# EAGLE design RTC_V2_pb (EAGLE 6.1)
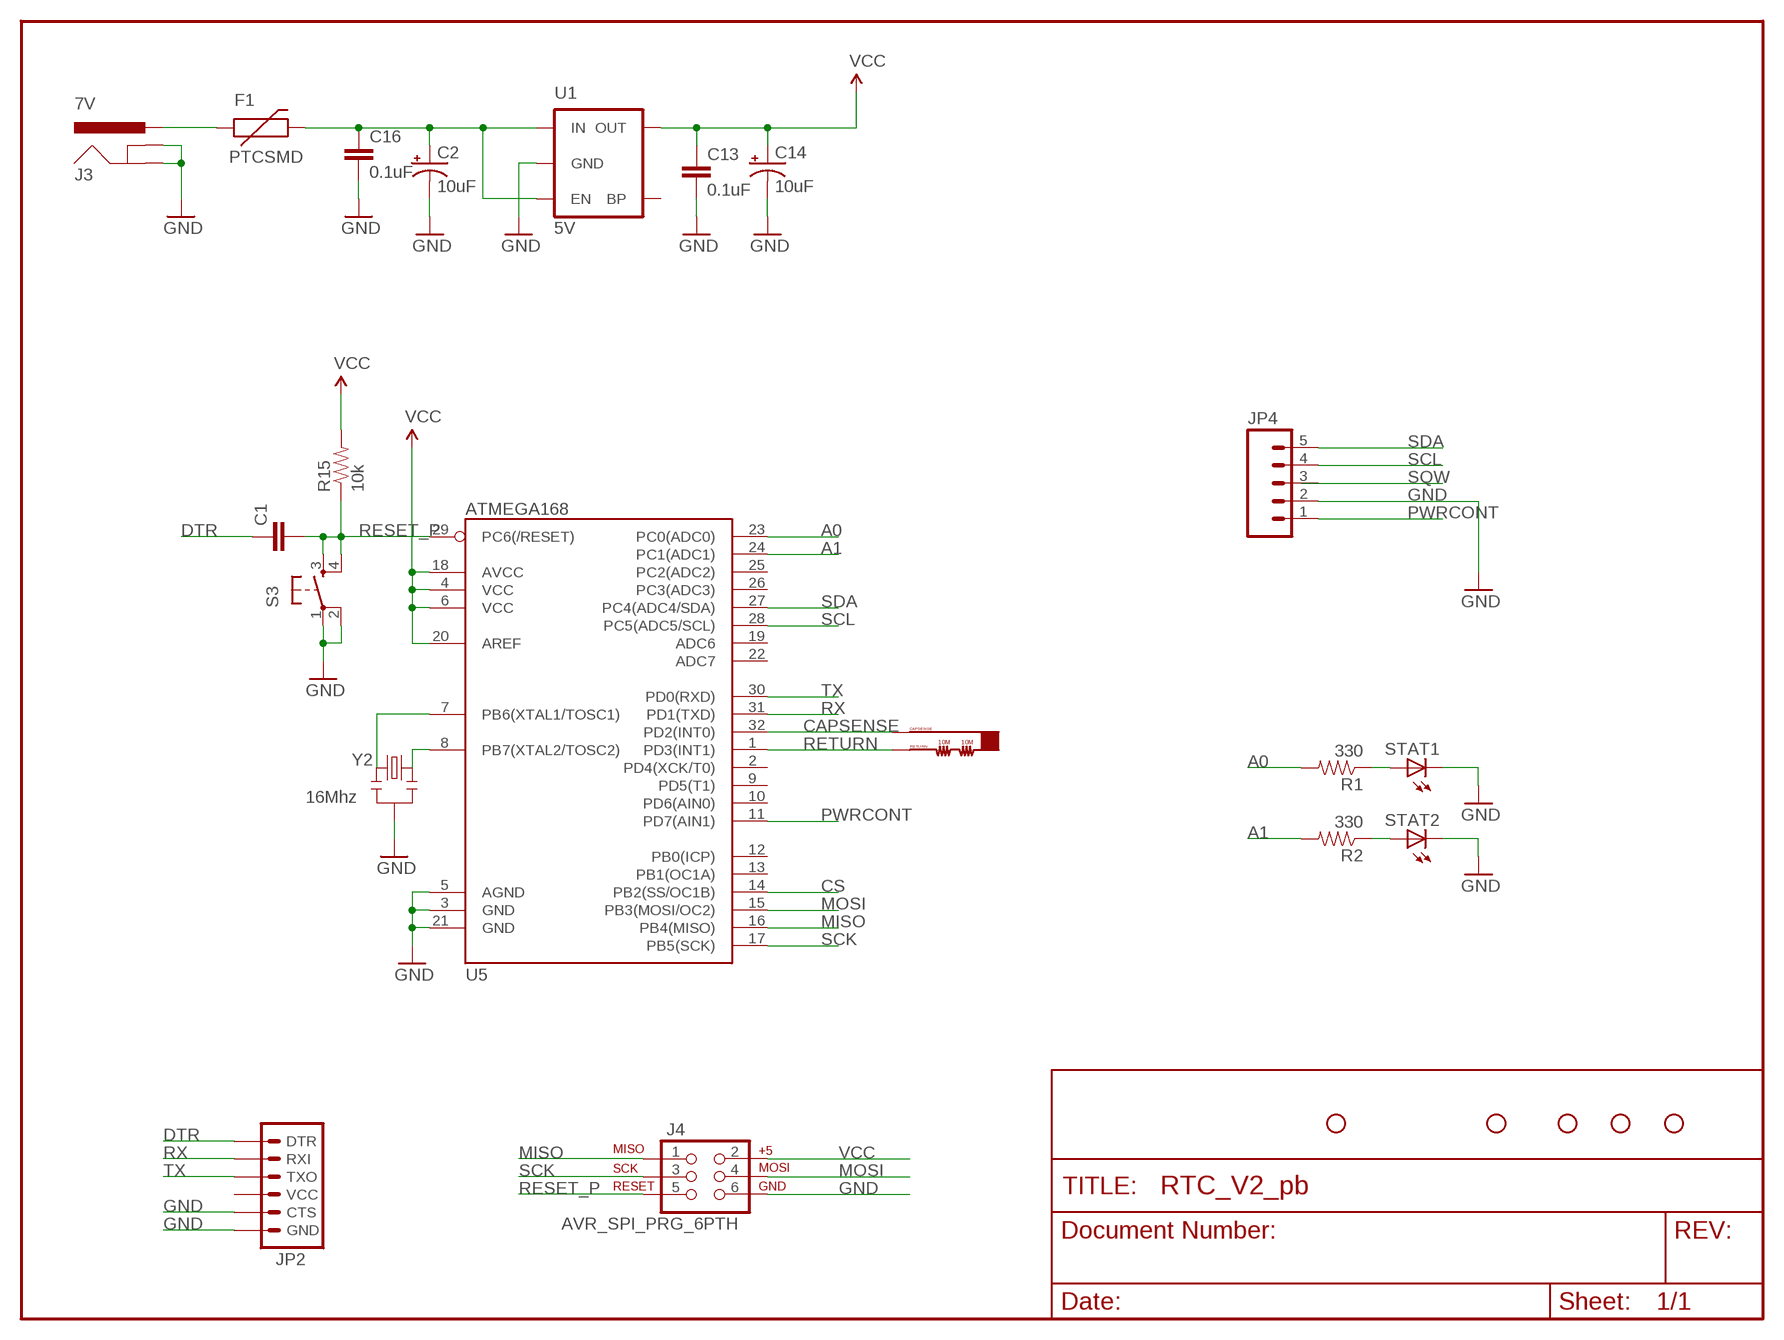
[diagram p0: schematic, sheet 1]

## Parts
C1  CAP0603-CAP  [0603-CAP]
C2  10uF  CAP_POL1206  [EIA3216]
C13  0.1uF  CAP0603-CAP  [0603-CAP]
C14  10uF  CAP_POL1206  [EIA3216]
C16  0.1uF  CAP0603-CAP  [0603-CAP]
F1  PTCSMD  [PTC-1206]
J3  7V  POWER_JACKPTH_LOCK  [POWER_JACK_PTH_LOCK]
J4  AVR_SPI_PRG_6PTH  [2X3]
JP1  STAND-OFFTIGHT  [STAND-OFF-TIGHT]
JP2  ARDUINO_SERIAL_PROGRAMPTH  [1X06]
JP4  M05PTH_LONGPADS  [1X05_LONGPADS]
JP7  STAND-OFFTIGHT  [STAND-OFF-TIGHT]
JP8  STAND-OFFTIGHT  [STAND-OFF-TIGHT]
JP9  STAND-OFFTIGHT  [STAND-OFF-TIGHT]
JP10  STAND-OFFTIGHT  [STAND-OFF-TIGHT]
R1  330  RESISTOR0603-RES  [0603-RES]
R2  330  RESISTOR0603-RES  [0603-RES]
R15  10k  RESISTOR0603-RES  [0603-RES]
S3  TAC_SWITCHPTH  [TACTILE-PTH]
STAT1  Yellow  LED1206  [LED-1206]
STAT2  Yellow  LED1206  [LED-1206]
U1  3.3V  V_REG_LDOSMD  [SOT23-5]
U5  ATMEGA168  [TQFP32-08]
U$3  CAPSENSE_BUTTON  [CAPSENSE_BUTTON]
Y2  8MHz  RESONATORSMD  [RESONATOR-SMD]

## Nets
A0: R1.2 U5.23(PC0(ADC0))
A1: R2.2 U5.24(PC1(ADC1))
CAPSENSE: U5.32(PD2(INT0)) U$3.CAPSENSE
CS: U5.14(PB2(SS/OC1B))
DTR: C1.1 JP2.1(DTR)
GND: C2.C(-) C13.2 C14.C(-) C16.2 J3.GND J3.GNDBREAK J4.6 JP2.5(CTS) JP2.6(GND) JP4.2 S3.1 S3.2 STAT1.C STAT2.C U1.2(GND) U5.3(GND) U5.5(AGND) U5.21(GND) Y2.2
MISO: J4.1 U5.16(PB4(MISO))
MOSI: J4.4 U5.15(PB3(MOSI/OC2))
N$1: R1.1 STAT1.A
N$2: R2.1 STAT2.A
N$4: C2.A(+) C16.1 F1.2 U1.1(IN) U1.3(EN)
N$141: U5.8(PB7(XTAL2/TOSC2)) Y2.3
N$142: U5.7(PB6(XTAL1/TOSC1)) Y2.1
PWRCONT: JP4.1 U5.11(PD7(AIN1))
RAW: F1.1 J3.PWR
RESET_P: C1.2 J4.5 R15.1 S3.3 S3.4 U5.29(PC6(/RESET))
RETURN: U5.1(PD3(INT1)) U$3.RETURN
RX: JP2.2(RXI) U5.31(PD1(TXD))
SCK: J4.3 U5.17(PB5(SCK))
SCL: JP4.4 U5.28(PC5(ADC5/SCL))
SDA: JP4.5 U5.27(PC4(ADC4/SDA))
TX: JP2.3(TXO) U5.30(PD0(RXD))
VCC: C13.1 C14.A(+) J4.2 R15.2 U1.5(OUT) U5.4(VCC) U5.6(VCC) U5.18(AVCC) U5.20(AREF)
Unconnected: JP2.4(VCC) JP4.3 U1.4(BP) U5.2(PD4(XCK/T0)) U5.9(PD5(T1)) U5.10(PD6(AIN0)) U5.12(PB0(ICP)) U5.13(PB1(OC1A)) U5.19(ADC6) U5.22(ADC7) U5.25(PC2(ADC2)) U5.26(PC3(ADC3))

## Notes on the sheet
- 5V
- 16Mhz

## Library data of the parts
C1 C13 C16 = SparkFun:CAP: Capacitor Standard 0603 ceramic capacitor, and 0.1" leaded capacitor.
C2 C14 = SparkFun:CAP_POL: Capacitor Polarized These are standard SMD and PTH capacitors. Normally 10uF, 47uF, and 100uF in electrolytic and tantalum varieties. Always verify the external diameter of the through hole cap, it varies with capacity, voltage, and manufacturer. The EIA devices should be standard.
F1 = SparkFun:PTC: Resettable Fuse PTC Resettable Fuse. Spark Fun Electronics SKU : COM-08357
J3 = SparkFun:POWER_JACK: Power Jack This is the standard 5.5mm barrel jack for power. The PTH is the most common, proven, reliable, footprint. All others are experimental. The Slot footprint only works if the mill layer is transmitted to the PCB fab house so be warned. Spark Fun Electronics SKU : PRT-00119. Mating wall wart : TOL-00298 (and others)
J4 = SparkFun:AVR_SPI_PRG_6: AVR ISP 6 Pin This is the reduced ISP connector for AVR programming. Common on Arduino. This footprint will take up less PCB space and can be used with a 10-pin to 6-pin adapter such as SKU: BOB-08508
JP1 JP7-JP10 = SparkFun:STAND-OFF: Stand Off This is the mechanical footprint for a #4 phillips button head screw. Use the keepout ring to avoid running the screw head into surrounding components. SKU : PRT-00447
JP2 = SparkFun:ARDUINO_SERIAL_PROGRAM
JP4 = SparkFun:M05: Header 5 Standard 5-pin 0.1" header. Use with straight break away headers (SKU : PRT-00116), right angle break away headers (PRT-00553), swiss pins (PRT-00743), machine pins (PRT-00117), and female headers (PRT-00115). Molex polarized connector foot print use with SKU : PRT-08230 with associated crimp pins and housings.
R1 R2 R15 = SparkFun:RESISTOR: Resistor Basic schematic elements and footprints for 0603, 1206, and PTH resistors.
S3 = SparkFun:TAC_SWITCH: Momentary Switch Button commonly used for reset or general input. Spark Fun Electronics SKU : COM-00097
STAT1 STAT2 = SparkFun:LED: LEDs Standard schematic elements and footprints for 5mm, 3mm, 1206, and 0603 sized LEDs. 5mm - Spark Fun Electronics SKU : COM-00529 (and others)
U1 = SparkFun:V_REG_LDO: Voltage Regulator LDO Standard 150mA LDO voltage regulator in SOT-23 layout. Micrel part MIC5205. BP (by-pass) pin is used to lower output noise with 470pF cap.
U5 = SparkFun:ATMEGA168
U$3 = Testing:CAPSENSE_BUTTON
Y2 = SparkFun:RESONATOR: Resonator Small SMD resonator. This is the itty bitty 10/20MHz resonators with built in caps. CSTCE10M0G55 and CSTCE20M0V53. Footprint has been reviewed closely but hasn't been tested yet.

## Board
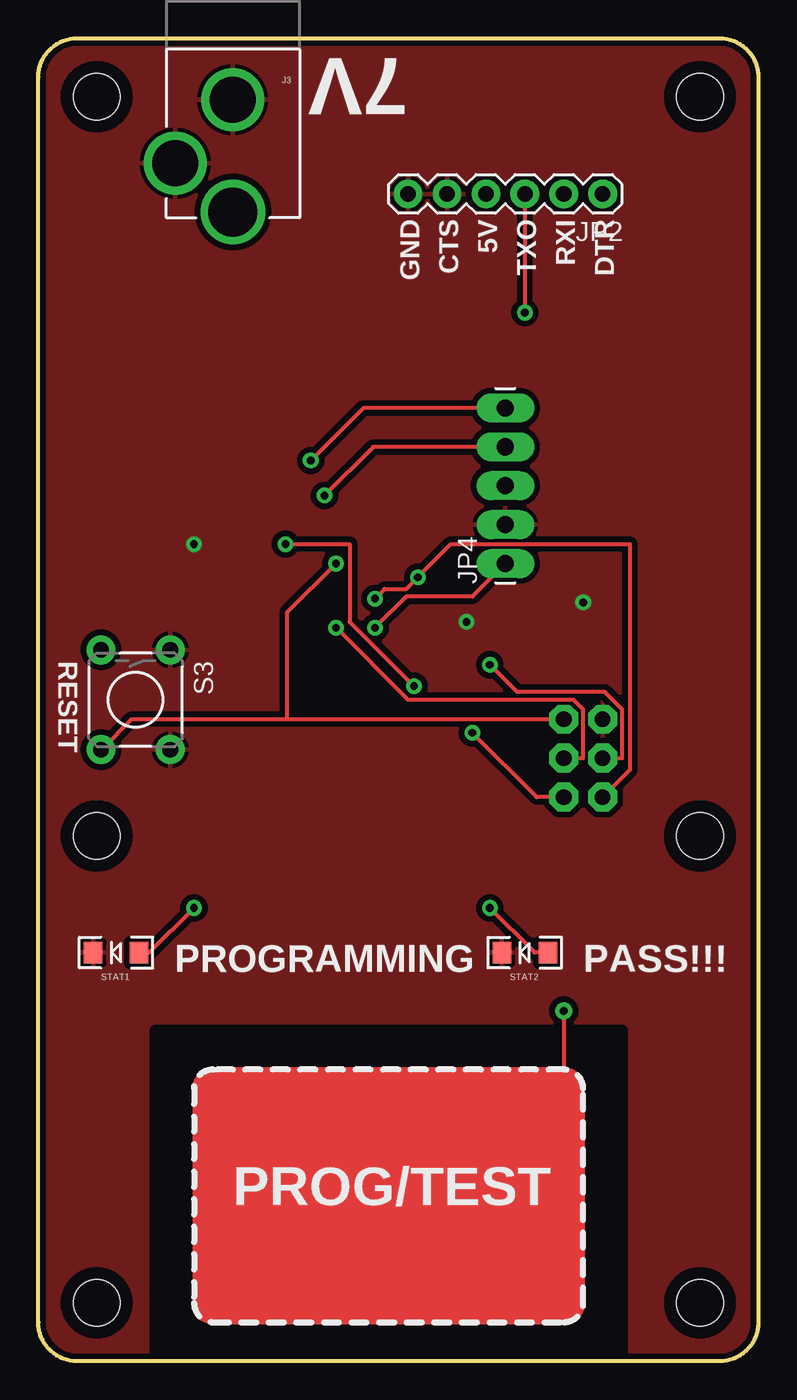
[diagram p1: board, top side]
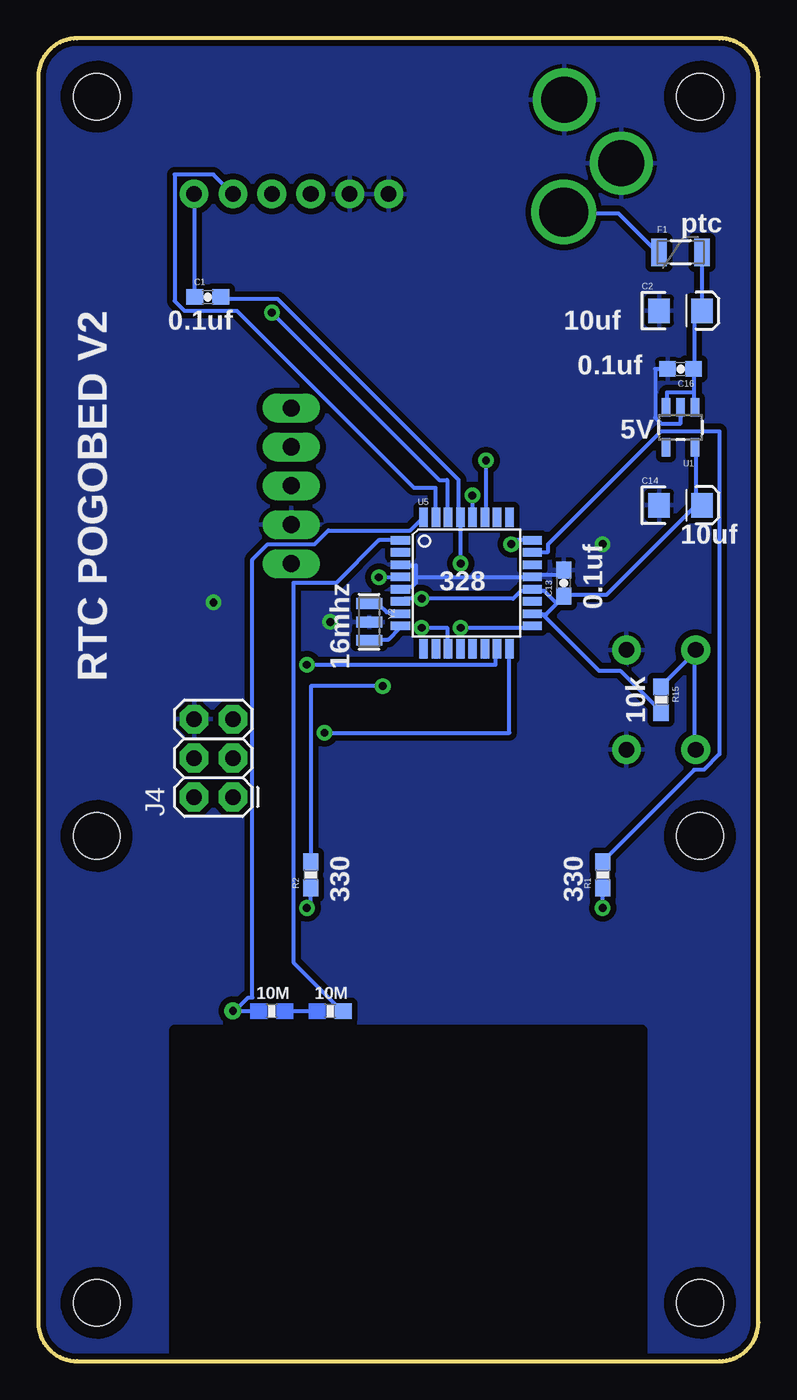
[diagram p2: board, bottom side, seen from below]

Size 46.99 x 86.36 mm. Coordinates in mm from the lower left corner, seen from the top.
Outline: 2.54,0 arc-90 0,2.54 0,83.82 arc-90 2.54,86.36 44.45,86.36 arc-90 46.99,83.82 46.99,2.54 arc-90 44.45,0 2.54,0
Copper layers (1*16): Top 0.035mm / dielectric 1.5mm / Bottom 0.035mm
Design rules: minimum track width 10mil, minimum drill 20mil, track to track 8mil, track to pad 8mil, pad to pad 8mil, via to via 8mil, smd to smd 8mil, copper to edge 8mil, drill to drill 8mil, minimum pad ring 12mil, minimum via ring 10mil, stop-mask expansion 4mil, vias tented up to drill 20mil, thermal gap 10mil

### Footprints (pad centres in the part's own frame; a part is rotated, then mirrored left to right if it is on the bottom)
0603-CAP = smd 1.1 x 1: 1 -0.85,0; 2 0.85,0
EIA3216 = smd 1.4 x 1.6: A 1.4,0; C -1.4,0
PTC-1206 = smd 1 x 1.8: 1 -1.4,0; 2 1.4,0
POWER_JACK_PTH_LOCK = drill 2.997 pad 4.115: GND 0.025,6.557; GNDBREAK 3.762,10.7 | drill 3.2 pad 4.115: PWR 0,13.878
2X3 = drill 1.016 pad 1.88 octagon: 1 0,0; 2 0,2.54; 3 2.54,0; 4 2.54,2.54; 5 5.08,0; 6 5.08,2.54
STAND-OFF-TIGHT = hole 3.048: 0,0
1X06 = drill 1.016 pad 1.88: 1 0,0; 2 2.54,0; 3 5.08,0; 4 7.62,0; 5 10.16,0; 6 12.7,0
1X05_LONGPADS = drill 1.118 pad 1.88 long: 1 0,0; 2 2.54,0; 3 5.08,0; 4 7.62,0; 5 10.16,0
0603-RES = smd 1.1 x 1: 1 -0.85,0; 2 0.85,0
TACTILE-PTH = drill 1.016 pad 1.88: 1 -3.251,2.261; 2 3.251,2.261; 3 -3.251,-2.261; 4 3.251,-2.261
LED-1206 = smd 1.2 x 1.4: A -1.5,0; C 1.5,0
SOT23-5 = smd 0.55 x 1.2: 1 -0.95,-1.3; 2 0,-1.3; 3 0.95,-1.3; 4 0.95,1.3; 5 -0.95,1.3
TQFP32-08 = smd 1.27 x 0.559: 1 -4.293,2.8; 2 -4.293,2; 3 -4.293,1.2; 4 -4.293,0.4; 5 -4.293,-0.4; 6 -4.293,-1.2; 7 -4.293,-2; 8 -4.293,-2.8; 17 4.293,-2.8; 18 4.293,-2; 19 4.293,-1.2; 20 4.293,-0.4; 21 4.293,0.4; 22 4.293,1.2; 23 4.293,2; 24 4.293,2.8 | smd 0.559 x 1.27: 9 -2.8,-4.293; 10 -2,-4.293; 11 -1.2,-4.293; 12 -0.4,-4.293; 13 0.4,-4.293; 14 1.2,-4.293; 15 2,-4.293; 16 2.8,-4.293; 25 2.8,4.293; 26 2,4.293; 27 1.2,4.293; 28 0.4,4.293; 29 -0.4,4.293; 30 -1.2,4.293; 31 -2,4.293; 32 -2.8,4.293
CAPSENSE_BUTTON = drill 0.508: CAPSENSE 11.43,11.43 | smd 1.1 x 1 bottom: RETURN 4.23,11.43
RESONATOR-SMD = smd 0.7 x 1.7: 1 -1.2,0; 2 0,0; 3 1.2,0

### Placement (x,y rotation side)
C1  35.94,69.47 0 bottom
C2  5.08,68.58 0 bottom
C13  12.7,50.8 90 bottom
C14  5.08,55.88 0 bottom
C16  5.08,64.77 180 bottom
F1  5.08,72.39 0 bottom
J3  12.7,88.9 180 top
J4  34.29,36.83 90 bottom
JP1  43.18,3.81 0 top
JP2  36.83,76.2 180 top
JP3  STAND-OFFTIGHT  [STAND-OFF-TIGHT]  3.81,3.81 0 top
JP4  30.48,52.07 90 top
JP7  43.18,82.55 0 top
JP8  3.81,34.29 0 top
JP9  43.18,34.29 0 top
JP10  3.81,82.55 0 top
R1  10.16,31.75 90 bottom
R2  29.21,31.75 90 bottom
R15  6.35,43.18 270 bottom
S3  6.35,43.18 270 top
STAT1  5.08,26.67 180 top
STAT2  31.75,26.67 180 top
U1  5.08,60.96 180 bottom
U5  19.05,50.8 0 bottom
U$3  22.86,11.43 0 top
Y2  25.4,48.26 270 bottom

### Tracks (layer width: path | path; a pad name or v marks a point on that pad's centre or on a via)
A0
  Bottom 0.254: R1.2 10.16,32.64 4.19,38.61 3.56,38.61 2.54,39.62 2.54,60.71 6.35,60.71 13.72,53.34 13.72,52.83 14.73,52.83 U5.23
A1  (via drill 0.51)
  Top 0.254: v24.51,44.07 20.32,48.26 20.32,53.34 v16.13,53.34
  Bottom 0.254: R2.2 29.21,44.07 v24.51,44.07 | v16.13,53.34 15.88,53.59 14.86,53.59 U5.24
CAPSENSE
  Bottom 0.254: U5.32 21.97,54.99 22.73,54.23 28.07,54.23 28.96,53.34 32,53.34 33.02,52.32 33.02,23.75 33.27,23.75 34.16,22.86 U$3.CAPSENSE
DTR
  Bottom 0.254: JP2.1 36.83,69.47 C1.1
GND  (via drill 0.51)
  Bottom 0.254: C13.2 12.7,51.56 12.95,51.31 14.73,51.31 U5.21 14.86,51.18 22.35,51.18 | 22.35,51.18 22.35,51.94 23.24,51.94 U5.3 | 22.35,51.18 22.35,50.8 22.61,50.55 23.11,50.55 23.24,50.42 U5.5 | U1.2 5.08,61.21 6.35,61.21 6.73,61.59 6.73,64.77 C16.2 | Y2.2 25.42,48.24
  other vias: 27.94,48.26 10.16,53.34 35.56,49.53
  pour Bottom (isolate 0.381): 0,0 46.99,0 46.99,86.36 0,86.36
  pour Top (isolate 0.381): 0,0 46.99,0 46.99,86.36 0,86.36
MISO  (via drill 0.51)
  Top 0.254: v28.32,41.02 32.51,36.83 J4.1
  Bottom 0.254: v28.32,41.02 16.26,41.02 16.26,46.48 U5.16
MOSI  (via drill 0.51)
  Top 0.254: v29.46,45.47 31.24,43.69 36.96,43.69 38.1,42.55 38.1,39.37 J4.4
  Bottom 0.254: v29.46,45.47 17.14,45.47 17.14,46.48 U5.15
N$1  (via drill 0.51)
  Top 0.254: v10.16,29.59 7.24,26.67 STAT1.A
  Bottom 0.254: v10.16,29.59 R1.1
N$2  (via drill 0.51)
  Top 0.254: v29.46,29.59 32.38,26.67 STAT2.A
  Bottom 0.254: R2.1 29.21,29.59 v29.46,29.59
N$4
  Bottom 0.254: 4.19,63.25 4.19,62.36 U1.1 | 4.19,63.25 4.19,64.77 | 4.19,63.25 5.97,63.25 5.97,62.36 U1.3 | C2.A F1.2 | 4.19,64.77 4.19,68.58 C2.A | 4.19,64.77 C16.1 | C2.A
N$141
  Bottom 0.254: U5.8 23.37,47.88 24.13,47.12 25.4,47.12 Y2.3
N$142
  Bottom 0.254: U5.7 23.37,48.9 24.26,48.9 24.77,49.4 25.4,49.4 Y2.1
PWRCONT  (via drill 0.51)
  Top 0.254: v21.97,47.88 24,49.91 28.32,49.91 JP4.1
  Bottom 0.254: v21.97,47.88 20.32,47.88 20.32,46.61 U5.11
RAW
  Bottom 0.254: F1.1 6.6,72.39 9.14,74.93 12.7,74.93 J3.PWR
RESET_P  (via drill 0.51)
  Top 0.254: 16.26,41.91 6.1,41.91 4.19,40.01 S3.4 | 16.26,41.91 J4.5 | v19.43,52.07 16.26,48.9 16.26,41.91
  Bottom 0.254: C1.2 35.05,69.47 34.92,69.34 31.37,69.34 19.56,57.53 19.56,55.12 U5.29 19.43,54.99 v19.43,52.07 | R15.1 6.35,44.07 4.06,46.35 S3.3 4.19,46.1 4.19,40.01 S3.4
RETURN
  Bottom 0.254: U$3.RETURN 27.18,22.86 30.35,26.04 30.35,50.8 27.56,50.8 24.77,53.59 23.37,53.59 U5.1
RX
  Bottom 0.254: JP2.2 35.56,77.47 38.1,77.47 38.1,69.22 37.47,68.58 34.04,68.58 22.48,57.02 21.08,57.02 21.08,55.12 U5.31
SCK  (via drill 0.51)
  Top 0.254: v19.43,47.88 24.13,43.18 34.92,43.18 35.56,42.55 35.56,39.37 J4.3
  Bottom 0.254: v19.43,47.88 14.86,47.88 U5.17
SCL  (via drill 0.51)
  Top 0.254: v18.67,56.52 21.84,59.69 JP4.4
  Bottom 0.254: v18.67,56.52 18.67,55.12 U5.28
SDA  (via drill 0.51)
  Top 0.254: v17.78,58.8 21.21,62.23 JP4.5
  Bottom 0.254: v17.78,58.8 17.78,55.12 U5.27
TX  (via drill 0.51)
  Top 0.254: JP2.3 v31.75,68.45
  Bottom 0.254: v31.75,68.45 20.83,57.53 20.32,57.53 20.32,55.12 U5.30
VCC  (via drill 0.51)
  Top 0.254: v21.97,49.78 22.61,50.42 24,50.42 v24.77,51.18 26.92,53.34 38.61,53.34 38.61,38.61 J4.2
  Bottom 0.254: 4.06,55.88 4.06,59.56 U1.5 | 4.06,55.88 C14.A | 14.03,48.7 14.1,48.77 14.73,48.77 U5.18 | 14.03,48.7 10.41,45.09 9.02,45.09 6.35,42.42 R15.2 | 13.14,49.47 13.84,48.77 13.97,48.77 14.03,48.7 | 13.14,49.47 12.7,49.91 C13.1 12.7,50.04 9.91,50.04 4.06,55.88 | 13.14,49.47 13.97,50.29 14.73,50.29 U5.20 14.86,50.29 15.49,50.29 16,49.78 v21.97,49.78 23.11,49.78 23.24,49.66 U5.6 | v24.77,51.18 23.37,51.18 U5.4

### Text on the board
tPlace: 7V | GND | CTS | 5V | TXO | RXI | DTR | RESET | PROGRAMMING | PASS!!! | PROG/TEST
bPlace: ptc | 0.1uf | RTC POGOBED V2 | 10uf | 0.1uf | 5V | 10uf | 0.1uf | 16mhz | 328 | 10k | 330 | 330
Reference: SDA | SCL | SQW | GND | 5V